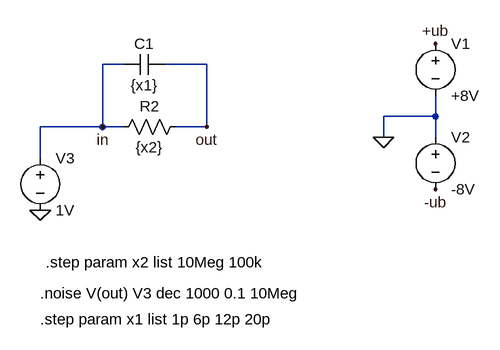
[diagram p0: schematic main.asc]
main.asc, the LTspice schematic file:
Version 4.1
SHEET 1 1428 680
WIRE 32 144 0 144
WIRE 160 144 96 144
WIRE 512 224 512 192
WIRE 512 224 432 224
WIRE 0 240 0 144
WIRE 0 240 -96 240
WIRE 32 240 0 240
WIRE 160 240 160 144
WIRE 160 240 112 240
WIRE 432 256 432 224
WIRE 512 256 512 224
WIRE -96 288 -96 240
FLAG 432 256 0
FLAG 512 336 -ub
FLAG 512 112 +ub
FLAG 160 240 out
FLAG 0 240 in
FLAG -96 368 0
SYMBOL res 128 224 R90
WINDOW 0 0 56 VBottom 2
WINDOW 3 32 56 VTop 2
SYMATTR InstName R2
SYMATTR Value {x2}
SYMBOL cap 96 128 R90
WINDOW 0 0 32 VBottom 2
WINDOW 3 32 32 VTop 2
SYMATTR InstName C1
SYMATTR Value {x1}
SYMBOL voltage 512 96 R0
WINDOW 123 0 0 Left 0
WINDOW 39 0 0 Left 0
SYMATTR InstName V1
SYMATTR Value +8V
SYMBOL voltage 512 240 R0
WINDOW 123 0 0 Left 0
WINDOW 39 0 0 Left 0
SYMATTR InstName V2
SYMATTR Value -8V
SYMBOL voltage -96 272 R0
WINDOW 123 0 0 Left 0
WINDOW 39 0 0 Left 0
SYMATTR InstName V3
SYMATTR Value 1V
TEXT -96 496 Left 2 !.noise V(out) V3 dec 1000 0.1 10Meg
TEXT -96 536 Left 2 !.step param x1 list 1p 6p 12p 20p
TEXT -88 448 Left 2 !.step param x2 list 10Meg 100k

The netlist it stands for:
* main.asc
R2 out in {x2}
C1 out in {x1}
V1 +ub 0 +8V
V2 0 -ub -8V
V3 in 0 1V
.noise V(out) V3 dec 1000 0.1 10Meg
.step param x1 list 1p 6p 12p 20p
.step param x2 list 10Meg 100k
.backanno
.end